# Altium schematic sheet 06_LEDS.SchDoc: LED
size A4; Author: Gabriel; Organization: Altium Limited; Address1: L3, 12a Rodborough Rd; Address2: Frenchs Forest; Address3: NSW; Address4: Australia 2086; Revision: v2.0; SheetNumber: 6; SheetTotal: 8; Subtitle: XDRONE
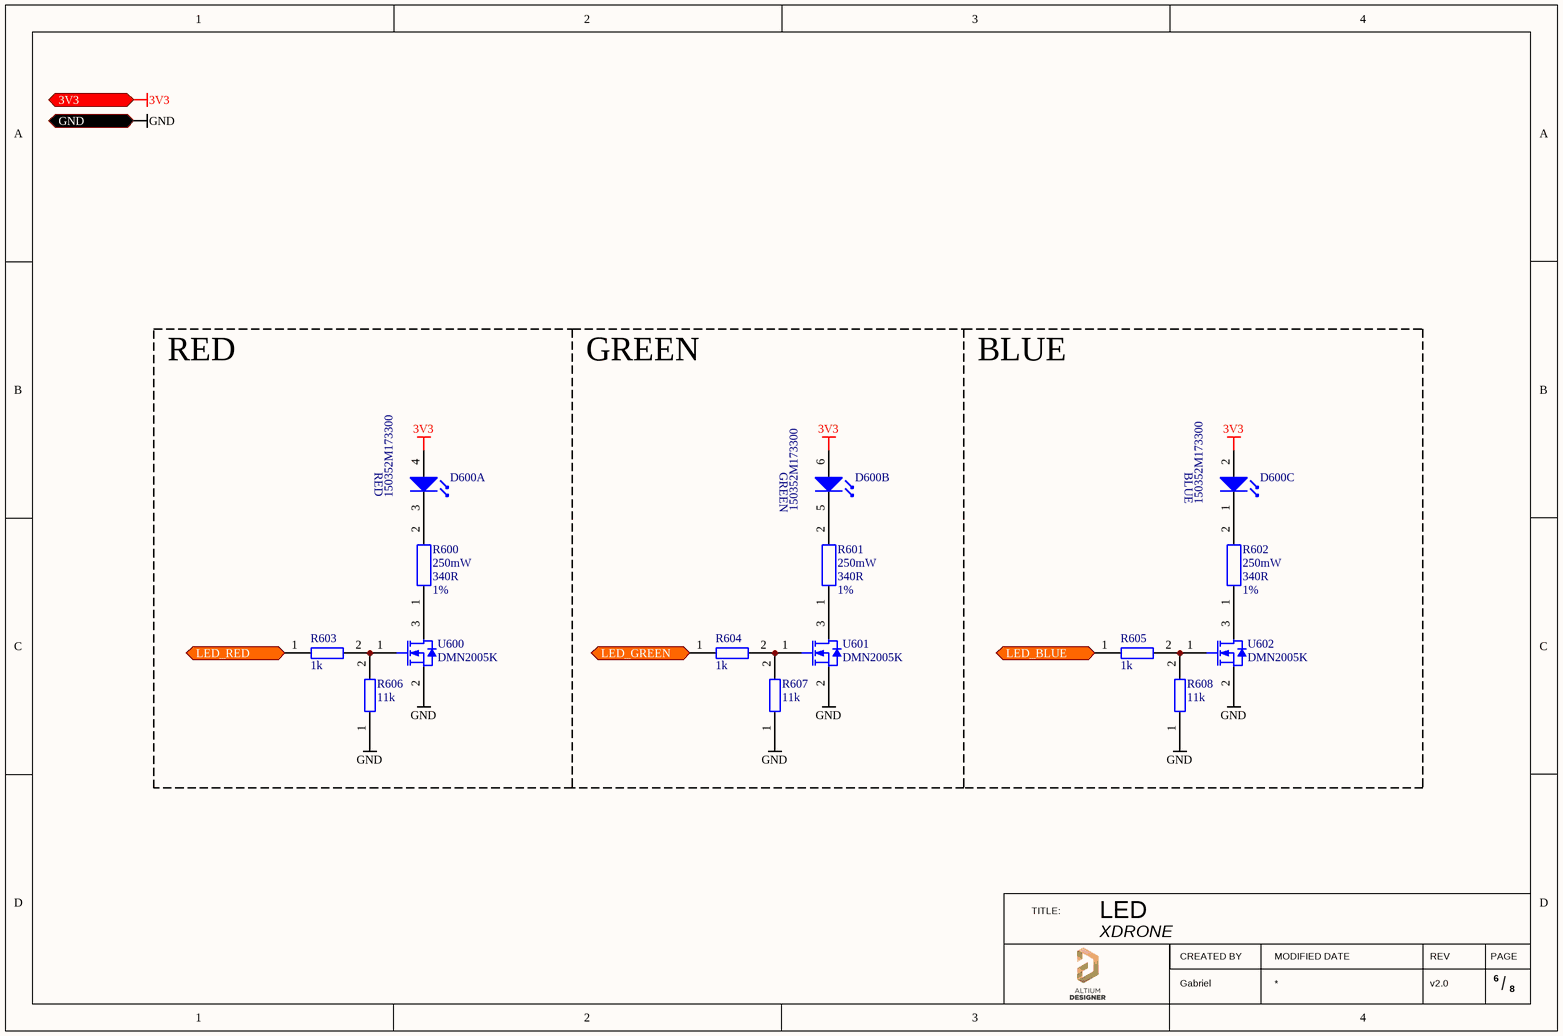
[diagram p0: 06_LEDS.SchDoc]

## Parts
D600  MANUFACTURER REFERENCE: 150352M173300  [6-PLCC]  (hidden comment: LED_PLCC6_RGB_150352M173300)  (parts A,B,C of 3)
R600  value 340R  MAX POWER DISSIPATION: 250mW  TOLERANCE: 1%  [RES_0805]  (hidden comment: RC_0805_340R_1/4W_1%_M)
R601  value 340R  MAX POWER DISSIPATION: 250mW  TOLERANCE: 1%  [RES_0805]  (hidden comment: RC_0805_340R_1/4W_1%_M)
R602  value 340R  MAX POWER DISSIPATION: 250mW  TOLERANCE: 1%  [RES_0805]  (hidden comment: RC_0805_340R_1/4W_1%_M)
R603  value 1k  [RES_0402]  (hidden comment: RES_1k_1%_0402_RC0402FR-071KL)
R604  value 1k  [RES_0402]  (hidden comment: RES_1k_1%_0402_RC0402FR-071KL)
R605  value 1k  [RES_0402]  (hidden comment: RES_1k_1%_0402_RC0402FR-071KL)
R606  value 11k  [RES_0402]  (hidden comment: RES_11k_5%_0402_ERJ-2GEJ113X)
R607  value 11k  [RES_0402]  (hidden comment: RES_11k_5%_0402_ERJ-2GEJ113X)
R608  value 11k  [RES_0402]  (hidden comment: RES_11k_5%_0402_ERJ-2GEJ113X)
U600  MANUFACTURER REFERENCE: DMN2005K  [SOT-23]  (hidden comment: MOS_N_1G_0.3A_DMN2005K)
U601  MANUFACTURER REFERENCE: DMN2005K  [SOT-23]  (hidden comment: MOS_N_1G_0.3A_DMN2005K)
U602  MANUFACTURER REFERENCE: DMN2005K  [SOT-23]  (hidden comment: MOS_N_1G_0.3A_DMN2005K)

## Blocks framed on the sheet
RED: D600 R600 R603 R606 U600

## Ports
3V3 (in), GND (in), LED_BLUE (in), LED_GREEN (in), LED_RED (in)

## Nets
3V3: D600.2(AB) D600.4(AR) D600.6(AG) ; port 3V3
GND: R606.1 R607.1 R608.1 U600.2(S) U601.2(S) U602.2(S) ; port GND
LED_BLUE: R605.1 ; port LED_BLUE
LED_GREEN: R604.1 ; port LED_GREEN
LED_RED: R603.1 ; port LED_RED
NetD600_1: D600.1(KB) R602.2
NetD600_3: D600.3(KR) R600.2
NetD600_5: D600.5(KG) R601.2
NetR600_1: R600.1 U600.3(D)
NetR601_1: R601.1 U601.3(D)
NetR602_1: R602.1 U602.3(D)
NetR603_2: R603.2 R606.2 U600.1(G)
NetR604_2: R604.2 R607.2 U601.1(G)
NetR605_2: R605.2 R608.2 U602.1(G)

## Notes on the sheet
- GREEN
- BLUE
- TITLE:
- CREATED BY
- MODIFIED DATE
- REV
- PAGE
- /
- (in symbol LED_PLCC6_RGB_150352M173300, part A) RED
- (in symbol LED_PLCC6_RGB_150352M173300, part B) GREEN
- (in symbol LED_PLCC6_RGB_150352M173300, part C) BLUE

## Library data of the parts
D600 = LED_PLCC6_RGB_150352M173300: CBI LED RGB PLCC6 150352M173300; MANUFACTURER: WURTH; DRAW BY: ToV; LATEST REVISION NOTE: CREATION; VF LED: 3.2V, 3.2V, 2V; IF LED: 20mA; LUMINOUS INTENSITY: 400mcd,1700mcd,750mcd; VIEWING ANGLE: 120°; DRAW DATE: 01/04/2021; LATEST REVISION DATE: 01/04/2021; STATUS: ACTIVE; OPERATING TEMPERATURE: -40 +85°C; TECHNOLOGY: LED; DISPLAY: *; DIMENSION: *; CHANNEL: *; ISOLATION: *; COLOR: RGB; ROHS: ROHS; UL94: -; WEIGHT: -; MOUNTING: SMD; PACKAGING: PLCC6
R600-R602 = RC_0805_340R_1/4W_1%_M: RESISTOR SMD 0805 340R 1/4W 1% METAL; MANUFACTURER: KOA; MANUFACTURER REFERENCE: RK73H2ATTD3400F; DRAW BY: ToV; LATEST REVISION NOTE: CREATION; DRAW DATE: 22/06/2021; LATEST REVISION DATE: 22/06/2021; STATUS: ACTIVE; MATERIAL: METAL; WEIGHT: -; TEMPERATURE COEFFICIENT: -; ROHS: -; MOUNTING: SMD; PACKAGING: 0805
R603-R605 = RES_1k_1%_0402_RC0402FR-071KL: RESISTOR 1k 1% 0402 RC0402FR-071KL; MANUFACTURER: YAGEO; VOLTAGE RATING: 50V; TOLERANCE: 1%; MOUNTING: SMD; MANUFACTURER REFERENCE: RC0402FR-071KL; PACKAGING: 0402
R606-R608 = RES_11k_5%_0402_ERJ-2GEJ113X: RESISTOR 11k 5% 0402 ERJ-2GEJ113X; MANUFACTURER: PANASONIC; VOLTAGE RATING: 50V; TOLERANCE: 5%; MOUNTING: SMD; MANUFACTURER REFERENCE: ERJ-2GEJ113X; PACKAGING: 0402
U600-U602 = MOS_N_1G_0.3A_DMN2005K: TRANSISTOR MOSFET N 0.3A 20V; MANUFACTURER: DIODES INC; DRAW BY: GFO; LATEST REVISION NOTE: CREATION; VCEsat/RDSon: 0.4@2.7V; VBEon/VGSth: 0.9V; VEB/VGSmax: 10V; PDmax: 0.35W; TJmax: 165°C; RTHJA: 357°C/W; UL94: V-0; DRAW DATE: 06/08/219; LATEST REVISION DATE: 06/08/2019; VALIDATED BY: -; STATUS: ACTIVE; OPERATING TEMPERATURE: -65 +150°C; TECHNOLOGY: MOSFET; TYPE: N; VCE/VDSmax: 20V; HFE/GFS: -; IC/IDmax: 0.3A; ROHS: ROHS; MOUNTING: SMD; PACKAGING: SOT-23-3